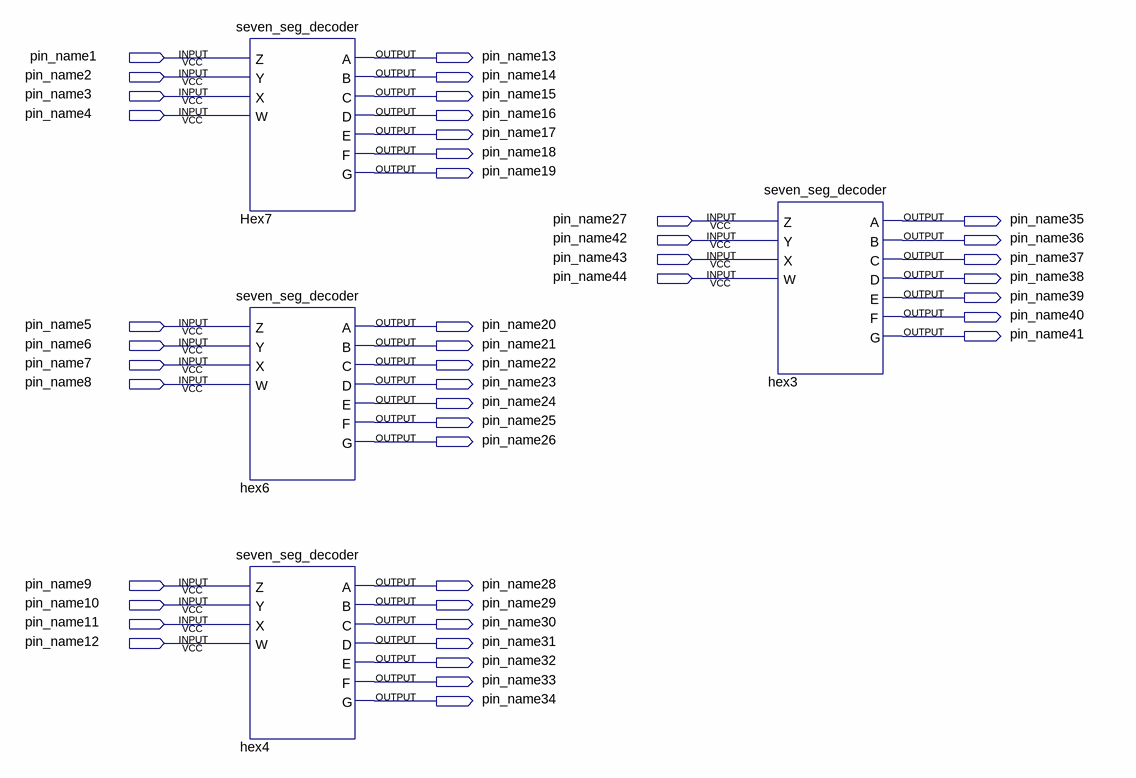
[diagram p0: schematic sheet]
// Quartus schematic lab5step1.bdf as structural Verilog: 4 symbols, 44 pins
module lab5step1 (
  input  pin_name1,
  input  pin_name2,
  input  pin_name3,
  input  pin_name4,
  input  pin_name27,
  input  pin_name42,
  input  pin_name43,
  input  pin_name44,
  input  pin_name5,
  input  pin_name6,
  input  pin_name7,
  input  pin_name8,
  input  pin_name9,
  input  pin_name10,
  input  pin_name11,
  input  pin_name12,
  output pin_name13,
  output pin_name14,
  output pin_name15,
  output pin_name16,
  output pin_name17,
  output pin_name18,
  output pin_name19,
  output pin_name35,
  output pin_name36,
  output pin_name37,
  output pin_name38,
  output pin_name39,
  output pin_name40,
  output pin_name20,
  output pin_name41,
  output pin_name21,
  output pin_name22,
  output pin_name23,
  output pin_name24,
  output pin_name25,
  output pin_name26,
  output pin_name28,
  output pin_name29,
  output pin_name30,
  output pin_name31,
  output pin_name32,
  output pin_name33,
  output pin_name34
);

  seven_seg_decoder Hex7 (
    .Z(pin_name1), .Y(pin_name2), .X(pin_name3), .W(pin_name4), .A(pin_name13), .B(pin_name14),
    .C(pin_name15), .D(pin_name16), .E(pin_name17), .F(pin_name18), .G(pin_name19));
  seven_seg_decoder hex6 (
    .Z(pin_name5), .Y(pin_name6), .X(pin_name7), .W(pin_name8), .A(pin_name20), .B(pin_name21),
    .C(pin_name22), .D(pin_name23), .E(pin_name24), .F(pin_name25), .G(pin_name26));
  seven_seg_decoder hex4 (
    .Z(pin_name9), .Y(pin_name10), .X(pin_name11), .W(pin_name12), .A(pin_name28), .B(pin_name29),
    .C(pin_name30), .D(pin_name31), .E(pin_name32), .F(pin_name33), .G(pin_name34));
  seven_seg_decoder hex3 (
    .Z(pin_name27), .Y(pin_name42), .X(pin_name43), .W(pin_name44), .A(pin_name35), .B(pin_name36),
    .C(pin_name37), .D(pin_name38), .E(pin_name39), .F(pin_name40), .G(pin_name41));
endmodule
